# EAGLE design BottomPCB-011713 (EAGLE 6.3)
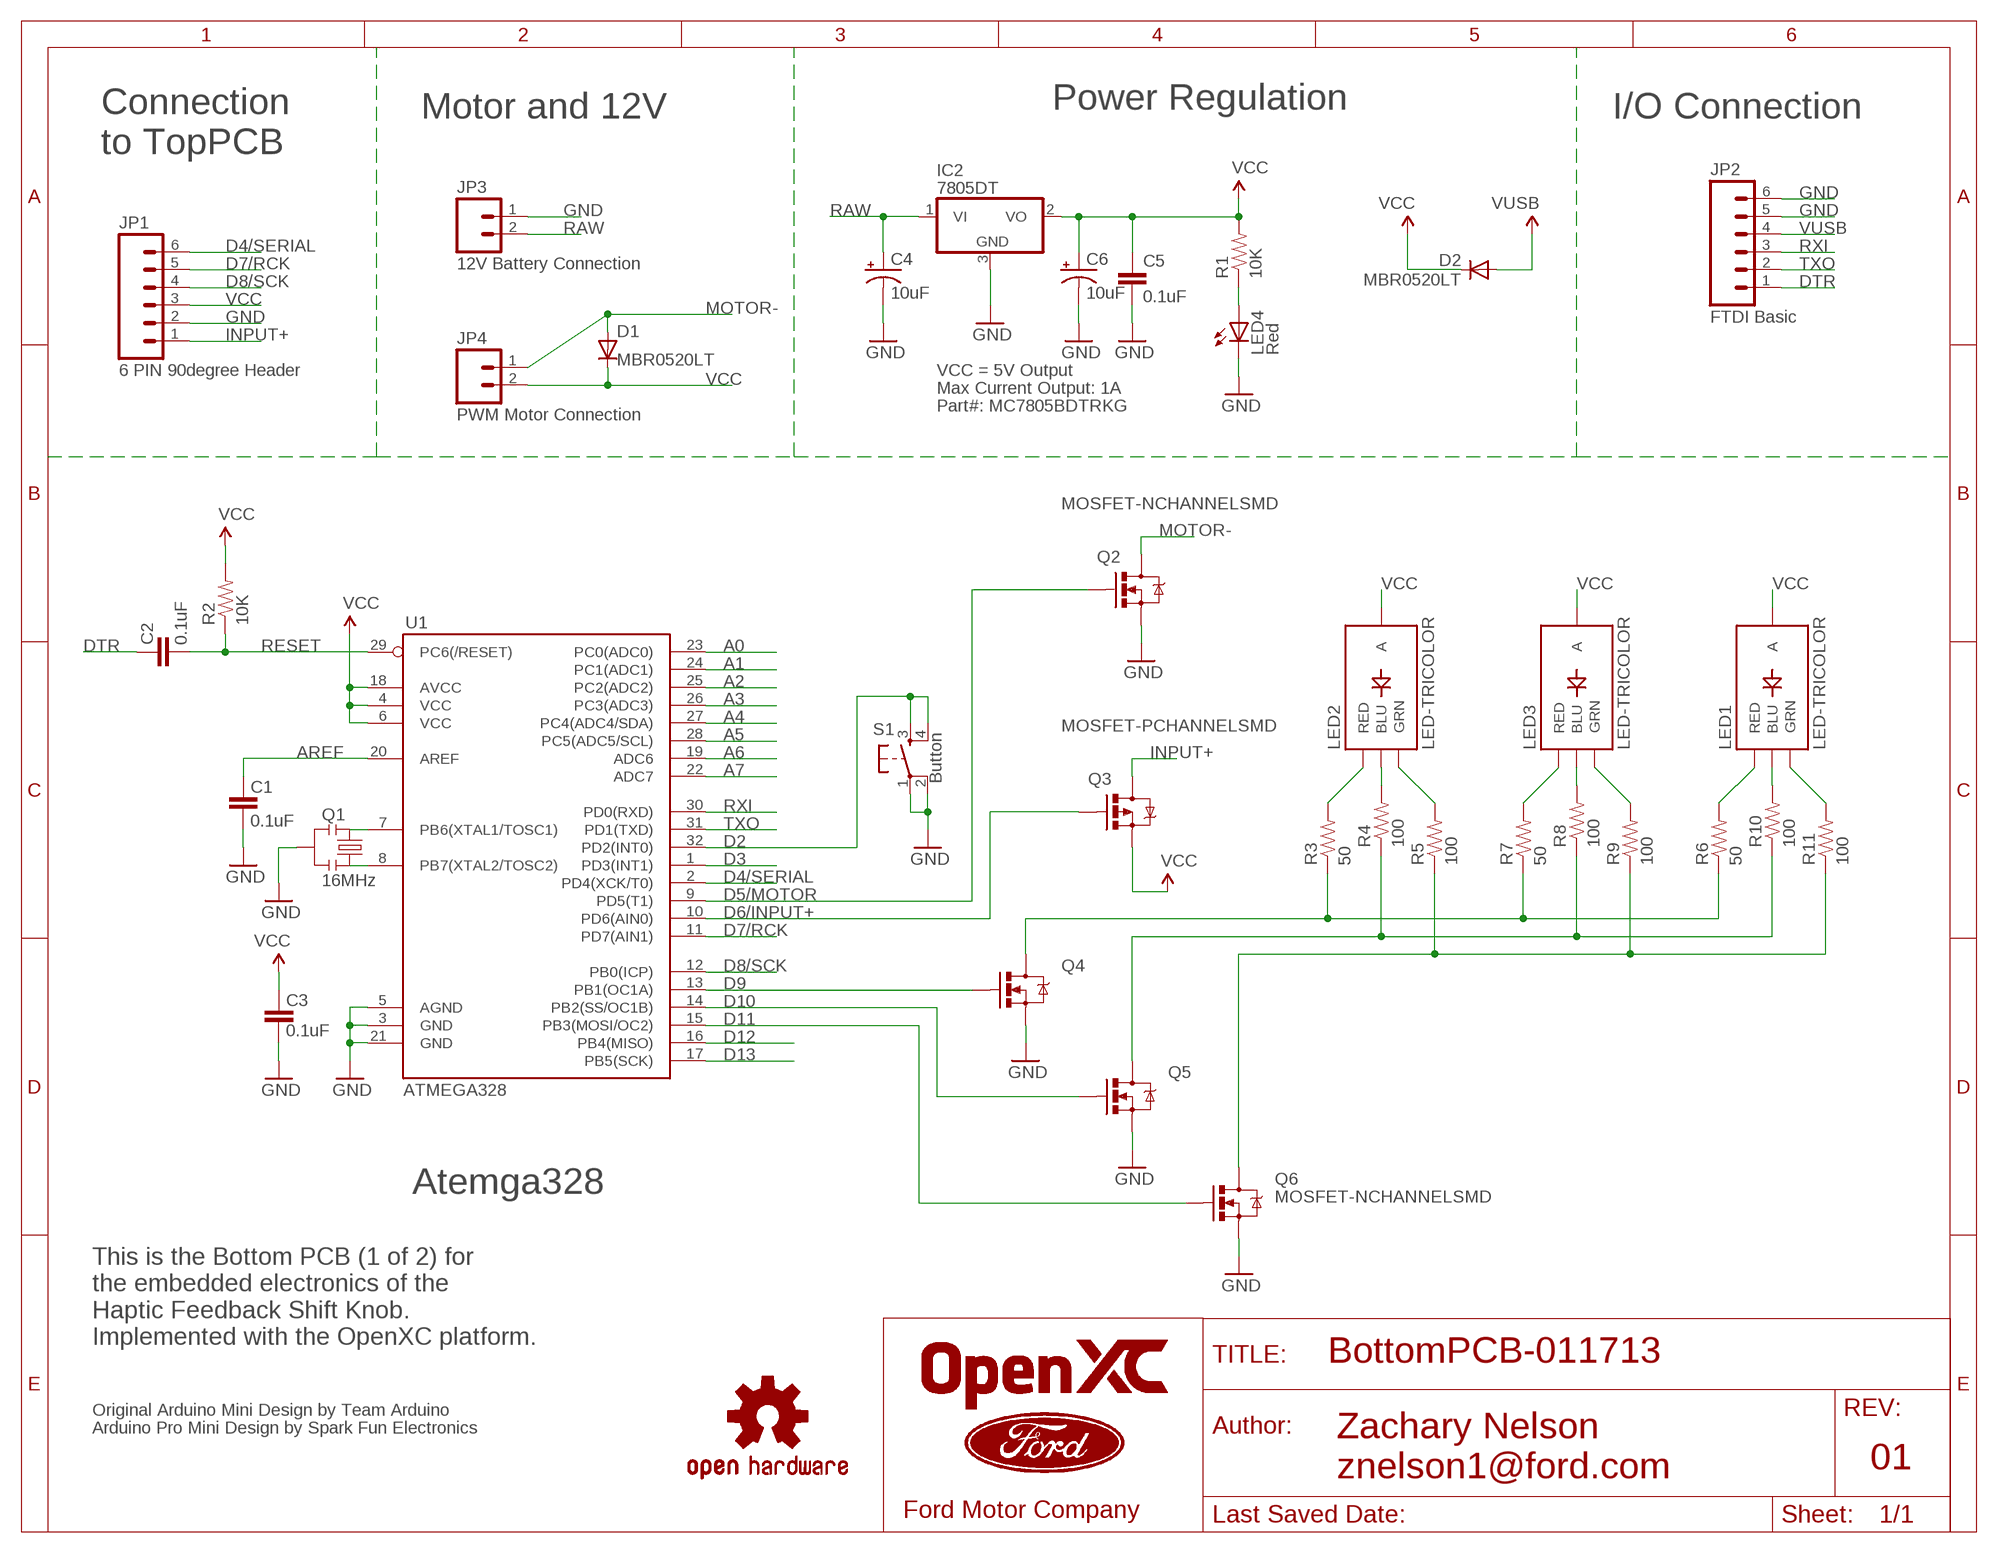
[diagram p0: schematic, sheet 1]

## Parts
C1  0.1uF  CAP0402-CAP  [0402-CAP]
C2  0.1uF  CAP0402-CAP  [0402-CAP]
C3  0.1uF  CAP0402-CAP  [0402-CAP]
C4  10uF  CAP_POL1206  [EIA3216]
C5  0.1uF  CAP0402-CAP  [0402-CAP]
C6  10uF  CAP_POL1206  [EIA3216]
D1  MBR0520LT  [SOD123]
D2  MBR0520LT  [SOD123]
IC2  7805DT  [TO252]
JP1  6 PIN 90degree Header  M06SIP  [1X06]
JP2  FTDI Basic  M06SIP  [1X06]
JP3  12V Battery Connection  M02-JST-2MM-SMT  [JST-2-SMD]
JP4  PWM Motor Connection  M02-JST-2MM-SMT  [JST-2-SMD]
LED1  LED-TRICOLOR  [LED-TRICOLOR-SMD]
LED2  LED-TRICOLOR  [LED-TRICOLOR-SMD]
LED3  LED-TRICOLOR  [LED-TRICOLOR-SMD]
LED4  Red  LED0603  [LED-0603]
Q1  16MHz  RESONATORSMD  [RESONATOR-SMD]
Q2  MOSFET-NCHANNELSMD  [SOT23-3]
Q3  MOSFET-PCHANNELSMD  [SOT23-3]
Q4  MOSFET-NCHANNELSMD  [SOT23-3]
Q5  MOSFET-NCHANNELSMD  [SOT23-3]
Q6  MOSFET-NCHANNELSMD  [SOT23-3]
R1  10K  RESISTOR0402-RES  [0402-RES]
R2  10K  RESISTOR0402-RES  [0402-RES]
R3  50  RESISTOR0805-RES  [0805]
R4  100  RESISTOR0805-RES  [0805]
R5  100  RESISTOR0805-RES  [0805]
R6  50  RESISTOR0805-RES  [0805]
R7  50  RESISTOR0805-RES  [0805]
R8  100  RESISTOR0805-RES  [0805]
R9  100  RESISTOR0805-RES  [0805]
R10  100  RESISTOR0805-RES  [0805]
R11  100  RESISTOR0805-RES  [0805]
S1  Button  TAC_SWITCHSMD  [TACTILE_SWITCH_SMD]
U1  ATMEGA328  ATMEGA168  [TQFP32-08]
U$3  OSHW-LOGOS  [OSHW-LOGO-S]

## Nets
A0: U1.23(PC0(ADC0))
A1: U1.24(PC1(ADC1))
A2: U1.25(PC2(ADC2))
A3: U1.26(PC3(ADC3))
A4: U1.27(PC4(ADC4/SDA))
A5: U1.28(PC5(ADC5/SCL))
A6: U1.19(ADC6)
A7: U1.22(ADC7)
AREF: C1.2 U1.20(AREF)
D2: S1.3 S1.4 U1.32(PD2(INT0))
D3: U1.1(PD3(INT1))
D4/SERIAL: JP1.6 U1.2(PD4(XCK/T0))
D5/MOTOR: Q2.1(G) U1.9(PD5(T1))
D6/INPUT+: Q3.1(G) U1.10(PD6(AIN0))
D7/RCK: JP1.5 U1.11(PD7(AIN1))
D8/SCK: JP1.4 U1.12(PB0(ICP))
D9: Q4.3(D) R3.1 R6.1 R7.1
D10: Q5.3(D) R4.1 R8.1 R10.1
D11: Q6.3(D) R5.1 R9.1 R11.1
D12: U1.16(PB4(MISO))
D13: U1.17(PB5(SCK))
DTR: C2.2 JP2.1
GND: C1.1 C3.1 C4.C(-) C5.2 C6.C(-) IC2.3(GND) JP1.2 JP2.5 JP2.6 JP3.1 LED4.C Q1.2 Q2.2(S) Q4.2(S) Q5.2(S) Q6.2(S) S1.1 S1.2 U1.3(GND) U1.5(AGND) U1.21(GND)
INPUT+: JP1.1 Q3.3(D)
MOTOR-: D1.A JP4.1 Q2.3(D)
N$1: Q1.1 U1.8(PB7(XTAL2/TOSC2))
N$2: Q1.3 U1.7(PB6(XTAL1/TOSC1))
N$3: LED4.A R1.1
N$4: LED2.R(RED) R3.2
N$5: LED2.G(GRN) R5.2
N$6: LED3.R(RED) R7.2
N$7: LED1.B(BLU) R10.2
N$8: LED3.G(GRN) R9.2
N$9: LED1.R(RED) R6.2
N$10: LED1.G(GRN) R11.2
N$11: Q4.1(G) U1.13(PB1(OC1A))
N$12: Q5.1(G) U1.14(PB2(SS/OC1B))
N$15: Q6.1(G) U1.15(PB3(MOSI/OC2))
N$16: LED3.B(BLU) R8.2
N$25: LED2.B(BLU) R4.2
RAW [vcc]: C4.A(+) IC2.1(VI) JP3.2
RESET: C2.1 R2.1 U1.29(PC6(/RESET))
RXI: JP2.3 U1.30(PD0(RXD))
TXO: JP2.2 U1.31(PD1(TXD))
VCC: C3.2 C5.1 C6.A(+) D1.C D2.C IC2.2(VO) JP1.3 JP4.2 LED1.A LED2.A LED3.A Q3.2(S) R1.2 R2.2 U1.4(VCC) U1.6(VCC) U1.18(AVCC)
VUSB: D2.A JP2.4

## Notes on the sheet
- Motor and 12V | Power Regulation | I/O Connection
- Connection
  to TopPCB
- VCC = 5V Output
- Max Current Output: 1A
- Part#: MC7805BDTRKG
- Atemga328
- This is the Bottom PCB (1 of 2) for 
  the embedded electronics of the 
  Haptic Feedback Shift Knob. 
  Implemented with the OpenXC platform.
- Original Arduino Mini Design by Team Arduino
- Arduino Pro Mini Design by Spark Fun Electronics
- 01
- Zachary Nelson
  znelson1@ford.com

## Library data of the parts
C1-C3 C5 = SparkFun:CAP: Capacitor Standard 0603 ceramic capacitor, and 0.1" leaded capacitor.
C4 C6 = SparkFun:CAP_POL: Capacitor Polarized These are standard SMD and PTH capacitors. Normally 10uF, 47uF, and 100uF in electrolytic and tantalum varieties. Always verify the external diameter of the through hole cap, it varies with capacity, voltage, and manufacturer. The EIA devices should be standard.
D1 D2 = diode:MBR0520LT: SCHOTTKY BARRIER RECTIFIER Source: http://onsemi.com .. MBR0520LT1-D.pdf
IC2 = linear:78*: Positive VOLTAGE REGULATOR Source: http://cache.national.com/ds/LM/LM78L05.pdf http://www.fairchildsemi.com/ds/LM/LM7805.pdf
JP1 JP2 = SparkFun-Connectors:M06: Header 6 Standard 6-pin 0.1" header. Use with straight break away headers (SKU : PRT-00116), right angle break away headers (PRT-00553), swiss pins (PRT-00743), machine pins (PRT-00117), and female headers (PRT-00115). Molex polarized connector foot print use with SKU : PRT-08094 with associated crimp pins and housings. NOTES ON THE VARIANTS LOCK and LOCK_LONGPADS... This footprint was designed to help hold the alignment of a through-hole component (i.e. 6-pin header) while soldering it into place. You may notice that each hole has been shifted either up or down by 0.005 of an inch from it's more standard position (which is a perfectly straight line). This slight alteration caused the pins (the squares in the middle) to touch the edges of the holes. Because they are alternating, it causes a "brace" to hold the component in place. 0.005 has proven to be the perfect amount of "off-center" position when using our standard breakaway headers. Although looks a little odd when you look at the bare footprint, once you have a header in there, the alteration is very hard to notice. Also, if you push a header all the way into place, it is covered up entirely on the bottom side. This idea of altering the position of holes to aid alignment will be further integrated into the Sparkfun Library for other footprints. It can help hold any component with 3 or more connection pins.
JP3 JP4 = SparkFun-Connectors:M02: Header 2 Standard 2-pin 0.1" header. Use with straight break away headers (SKU : PRT-00116), right angle break away headers (PRT-00553), swiss pins (PRT-00743), machine pins (PRT-00117), and female headers (PRT-00115). Molex polarized connector foot print use with SKU : PRT-08233 with associated crimp pins and housings.; PROD_ID: CONN-08352
LED1-LED3 = SparkFun:LED-TRICOLOR: Tri-Color LED SMD Proven layout and schematic for triple color LED in SMD package - common anode. Spark Fun Electronics SKU : COM-07844
LED4 = SparkFun:LED: LEDs Standard schematic elements and footprints for 5mm, 3mm, 1206, and 0603 sized LEDs. 5mm - Spark Fun Electronics SKU : COM-00529 (and others)
Q1 = SparkFun:RESONATOR: Resonator Small SMD resonator. This is the itty bitty 10/20MHz resonators with built in caps. CSTCE10M0G55 and CSTCE20M0V53. Footprint has been reviewed closely but hasn't been tested yet.
Q2 Q4-Q6 = SparkFun-DiscreteSemi:MOSFET-NCHANNEL: Generic NMOS footprint
Q3 = SparkFun-DiscreteSemi:MOSFET-PCHANNEL: Generic PMOSFET
R1 R2 = SparkFun:RESISTOR: Resistor Basic schematic elements and footprints for 0603, 1206, and PTH resistors.
R3-R11 = SparkFun-Resistors:RESISTOR: Resistor Basic schematic elements and footprints for 0603, 1206, and PTH resistors.
S1 = SparkFun:TAC_SWITCH: Momentary Switch Button commonly used for reset or general input. Spark Fun Electronics SKU : COM-00097
U1 = SparkFun:ATMEGA168
U$3 = SparkFun:OSHW-LOGO: Open Source Hardware Logo This logo indicates the piece of hardware it is found on incorporates a OSHW license and/or adheres to the definition of open source hardware found here: http://freedomdefined.org/OSHW

## Net classes
1 vcc: width 0.254 mm

## Board
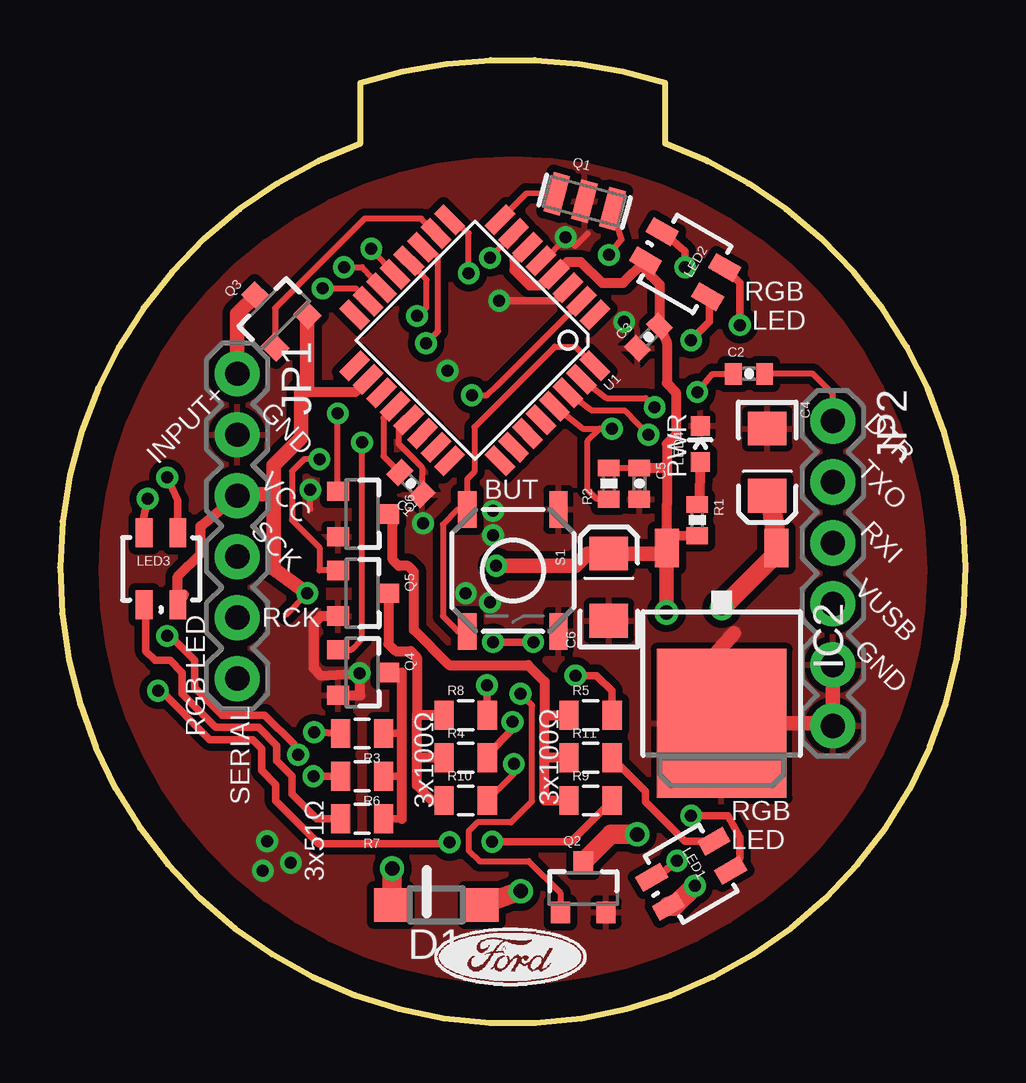
[diagram p1: board, top side]
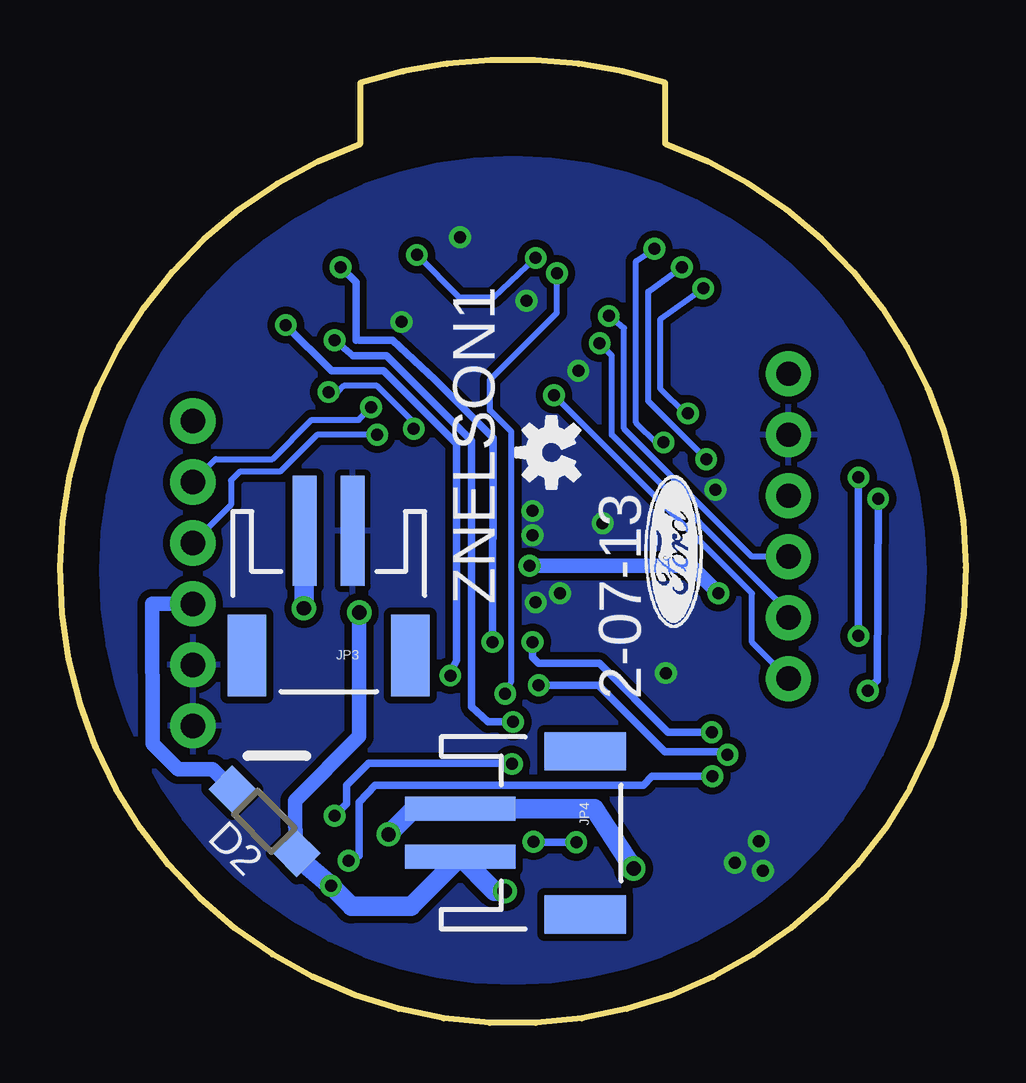
[diagram p2: board, bottom side, seen from below]

Size 37.76 x 40.12 mm. Coordinates in mm from the lower left corner, seen from the top.
Outline: 12.53,36.64 12.53,39.18 arc-35 25.23,39.18 25.23,36.64 arc-321 12.53,36.64
Copper layers (1*16): Top 0.0178mm / dielectric 59mil / Bottom 0.0178mm
Design rules "SSC-EAGLE-2Lyr_v1.0.0.3": minimum track width 6mil, minimum drill 14mil, track to track 6mil, track to pad 6mil, pad to pad 6mil, via to via 6mil, smd to smd 6mil, copper to edge 20mil, drill to drill 16mil, minimum pad ring 8mil, minimum via ring 8mil, stop-mask expansion 3mil, vias tented up to drill 0mil, thermal gap 10mil

### Footprints (pad centres in the part's own frame; a part is rotated, then mirrored left to right if it is on the bottom)
0402-CAP = smd 0.7 x 0.9: 1 -0.65,0; 2 0.65,0
EIA3216 = smd 1.4 x 1.6: A 1.4,0; C -1.4,0
SOD123 = smd 1.4 x 1.4: A 1.9,0; C -1.9,0
TO252 = smd 1 x 1.6: 1 -2.28,-4.8; 2 2.28,-4.8 | smd 5.4 x 6.2: 3 0,2.5
1X06 = drill 1.016 pad 1.88: 1 0,0; 2 2.54,0; 3 5.08,0; 4 7.62,0; 5 10.16,0; 6 12.7,0
JST-2-SMD = smd 1 x 4.6: 1 -1,-3.7; 2 1,-3.7 | smd 1.6 x 3.4: NC1 -3.4,1.5; NC2 3.4,1.5
LED-TRICOLOR-SMD = smd 0.7 x 1.2: A 0.7,-1.5; B 0.7,1.5; G -0.7,1.5; R -0.7,-1.5
LED-0603 = smd 0.8 x 0.8: A 0,-0.75; C 0,0.75
RESONATOR-SMD = smd 0.7 x 1.7: 1 -1.2,0; 2 0,0; 3 1.2,0
SOT23-3 = smd 0.8 x 0.9: 1 -0.95,-1; 2 0.95,-1; 3 0,1.1
0402-RES = smd 0.7 x 0.9: 1 -0.65,0; 2 0.65,0
0805 = smd 0.8 x 1.2: 1 -0.9,0; 2 0.9,0
TACTILE_SWITCH_SMD = smd 1.524 x 0.762: 1 -2.54,1.905; 2 2.54,1.905; 3 -2.54,-1.905; 4 2.54,-1.905
TQFP32-08 = smd 1.27 x 0.559: 1 -4.293,2.8; 2 -4.293,2; 3 -4.293,1.2; 4 -4.293,0.4; 5 -4.293,-0.4; 6 -4.293,-1.2; 7 -4.293,-2; 8 -4.293,-2.8; 17 4.293,-2.8; 18 4.293,-2; 19 4.293,-1.2; 20 4.293,-0.4; 21 4.293,0.4; 22 4.293,1.2; 23 4.293,2; 24 4.293,2.8 | smd 0.559 x 1.27: 9 -2.8,-4.293; 10 -2,-4.293; 11 -1.2,-4.293; 12 -0.4,-4.293; 13 0.4,-4.293; 14 1.2,-4.293; 15 2,-4.293; 16 2.8,-4.293; 25 2.8,4.293; 26 2,4.293; 27 1.2,4.293; 28 0.4,4.293; 29 -0.4,4.293; 30 -1.2,4.293; 31 -2,4.293; 32 -2.8,4.293

### Placement (x,y rotation side)
C1  14.63,22.48 135 top
C2  28.72,27.05 0 top
C3  24.53,28.57 45 top
C4  29.49,23.37 270 top
C5  24.15,22.48 270 top
C6  22.88,18.16 90 top
D1  15.69,4.92 180 top
D2  29.23,8.41 135 bottom
IC2  27.58,14.98 180 top
JP1  7.39,27.05 270 top
JP2  32.22,25.08 270 top
JP3  26.56,16.81 180 bottom
JP4  17.37,7.92 270 bottom
LED1  26.31,6.22 300 top
LED2  26.06,31.62 240 top
LED3  4.21,18.92 0 top
LED4  26.69,24.13 0 top
Q1  21.87,34.24 345 top
Q2  21.81,5.61 0 top
Q3  8.93,29.53 45 top
Q4  12.6,14.6 270 top
Q5  12.6,17.91 270 top
Q6  12.6,21.21 270 top
R1  26.57,20.95 270 top
R2  22.88,22.48 90 top
R3  12.6,12.06 180 top
R4  16.91,11.05 0 top
R5  22.12,12.83 0 top
R6  12.6,10.29 180 top
R7  12.6,8.51 180 top
R8  16.91,12.83 0 top
R9  22.12,9.27 0 top
R10  16.91,9.27 0 top
R11  22.12,11.05 0 top
S1  18.88,18.86 270 top
U1  17.29,28.45 225 top
U$1  [DOCFIELD]  -49.7,-52.26 0 top  (outside the outline)
U$3  17.27,23.77 90 bottom

### Tracks (layer width: path | path; a pad name or v marks a point on that pad's centre or on a via)
AREF
  Top 0.254: U1.20 13.48,25.2 13.48,23.62 C1.2
D2
  Top 0.254: S1.3 17.05,21.4 | U1.32 22.28,27.39 21.5,28.18 20.63,28.18 17.28,24.82 17.28,22.97 16.97,22.67 S1.3 | S1.3 16.59,21.4 15.96,20.76 15.96,16.95 16.59,16.32 S1.4
D4/SERIAL  (via drill 0.5 pad 0.41)
  Top 0.254: v17.17,26.16 17.8,26.16 18.22,26.54 U1.2
  Top 0.305: 21.71,30.19 U1.2
  Bottom 0.254: JP1.6 8.91,15.87 8.91,17.91 v17.17,26.16
D5/MOTOR  (via drill 0.5 pad 0.41)
  Top 0.254: v17.04,31.24 17.04,32.91 U1.9 | v19.2,13.71 19.68,13.23 19.68,9.24 18.79,8.36 17.4,8.36 17.04,8 17.04,7.19 17.49,6.74 19.54,6.74 20.86,5.42 Q2.1
  Bottom 0.254: v19.2,13.71 18.95,14.22 18.95,24.64 19.83,25.53 19.83,26.8 17.04,29.59 v17.04,31.24
D6/INPUT+
  Top 0.254: U1.10 15.06,33.51 12.71,33.51 8.97,29.77 Q3.1
D7/RCK  (via drill 0.5 pad 0.41)
  Top 0.254: v15.26,28.32 15.77,28.83 15.77,31.92 U1.11
  Bottom 0.254: JP1.5 7.39,17.14 14.75,24.51 14.75,27.81 v15.26,28.32
D8/SCK  (via drill 0.5 pad 0.41)
  Top 0.254: v14.88,29.46 15.27,29.8 15.29,30.97 U1.12
  Bottom 0.254: JP1.4 8.91,19.43 14.25,24.76 14.25,28.95 v14.88,29.46
D9
  Top 0.305: 14.25,8.51 R7.1 | R6.1 14.25,10.29 | R3.1 14.25,12.06
  Top 0.406: Q4.3 14.25,14.6 14.25,12.06 14.25,10.29 14.25,8.51
D10
  Top 0.406: R8.1 14.88,12.83 | R4.1 14.88,11.05 | 14.88,11.05 14.88,12.83 | R10.1 15.52,9.27 14.88,9.9 14.88,11.05 | Q5.3 13.7,15.79 13.99,15.49 14.63,15.49 14.88,15.24 14.88,12.83
D11
  Top 0.406: 20.2,12.83 20.2,14.22 19.52,14.91 16.23,14.91 14.75,16.38 14.75,18.79 14.5,19.05 14.12,19.05 13.87,19.3 13.87,20.78 arc90 Q6.3 | 20.2,12.83 R5.1 | R11.1 20.2,11.05 | 20.2,11.05 20.2,12.83 | R9.1 20.2,9.27 20.2,11.05
DTR
  Top 0.254: JP2.1 32.22,26.22 31.39,27.05 C2.2
GND  (via drill 0.5)
  Top 0.254: 10.44,21.42 v10.44,22.22 | U1.21 14.12,24.71 14.12,24.13 15.09,23.16 C1.1 | U1.5 20.34,31.93 v21.08,32.74 21.49,32.38 21.99,32.89
  Top 0.305: U1.3 20.64,30.1 v18.31,30.1
  Top 0.406: Q4.2 12.52,13.65 v12.49,14.58 10.88,14.48 10.56,14.79 10.56,16.64 10.88,16.96 Q5.2
  Top 0.61: JP2.5 JP2.6 32.11,12.48 IC2.3 27.33,15.37 28.09,16.23
  other vias: 18.06,21.33 16.15,27.18 23.52,29.21 15.14,20.83 18.06,20.32 9.62,6.68 8.46,6.35 8.63,7.57 16.91,17.91 17.93,17.52
  pour Top (isolate 0.305): 1.73,18.86 arc-90 18.88,36 arc-90 36.02,18.86 arc-90 18.88,1.71 arc-90
  pour Bottom (isolate 0.305): 1.73,18.86 arc-90 18.88,36 arc-90 36.02,18.86 arc-90 18.88,1.71 arc-90
INPUT+
  Top 0.61: Q3.3 7.39,29.54 JP1.1
MOTOR-  (via drill 0.6)
  Top 0.813: Q2.3 22.96,7.86 v24.06,7.86 | D1.A 13.85,5.52 v13.85,6.43
  Bottom 0.813: v24.06,7.86 23,8.92 JP4.1 15.48,8.92 v13.85,6.43
N$1
  Top 0.254: Q1.1 19.45,34.57 U1.8
N$2  (via drill 0.5 pad 0.3, 0.5 pad 0.41)
  Top 0.254: v22.88,32 23.41,32.65 Q1.3 | v17.93,31.88 18.02,32 U1.7
  Bottom 0.254: v17.93,31.88 19.71,30.22 21.1,30.22 v22.88,32
N$3
  Top 0.406: R1.1 26.67,21.58 LED4.A
N$4  (via drill 0.5 pad 0.3)
  Top 0.305: R3.2 v10.59,12.11 | v18.06,15.87 v19.73,15.87 | v26.06,31.49 26.06,32.16 LED2.R
  Bottom 0.254: 25.3,28.45 25.42,28.45
  Bottom 0.305: v10.59,12.11 12.42,12.11 15.26,14.98 17.8,14.98 18.06,15.24 v18.06,15.87 | v19.73,15.87 19.71,24.38 22.12,26.8 23.9,28.45 25.3,28.45 | 25.42,28.45 25.42,30.86 v26.06,31.49
N$5  (via drill 0.5 pad 0.41)
  Top 0.305: R5.2 23.02,12.94 23.01,12.95 23.01,13.84 22.37,14.48 v21.49,14.48 | v28.34,29.08 28.34,30.84 LED2.G
  Bottom 0.305: v21.49,14.48 21.49,14.6 21.23,15.11 21.23,24.13 24.28,27.18 26.44,27.18 v28.34,29.08
N$6
  Top 0.305: R7.2 10.69,8.51 9.67,9.52 9.67,10.29 9.04,10.92 9.04,11.56 8.28,12.32 6.5,12.32 5.1,13.71 5.1,14.6 4.59,15.11 3.96,15.11 3.58,15.49 3.58,17.36 LED3.R
N$7  (via drill 0.5 pad 0.41)
  Top 0.254: 17.94,9.4 18.92,10.38 v18.92,10.79
  Top 0.305: LED1.B 28.34,6.88 28.34,7.75 27.84,8.63 v26.31,8.63 | R10.2 17.94,9.4
  Bottom 0.305: v26.31,8.63 25.8,9.14 25.8,9.9 24.89,10.82 19.02,10.82 v18.92,10.79
N$8  (via drill 0.5, 0.5 pad 0.41)
  Top 0.305: v3.65,21.84 3.45,20.87 LED3.G | v4.09,13.84 4.21,13.84 6.25,11.81 8.02,11.81 8.4,11.43 8.4,10.54 9,9.92 9,9.25 10.78,7.48 16.19,7.48 v16.24,7.53 | R9.2 21.3,7.55 v18.02,7.55
  Bottom 0.305: v3.65,21.84 3.68,14.27 v4.09,13.84 | v18.02,7.55 17.99,7.53 v16.24,7.53
N$9  (via drill 0.5 pad 0.41)
  Top 0.305: R6.2 v10.56,10.29 | v25.73,6.75 24.77,5.97 LED1.R
  Bottom 0.305: v25.73,6.75 25.3,6.96 25.3,9.21 24.62,9.9 18.31,9.9 arc0 13.44,9.91 13.07,10.29 v10.56,10.29
N$10
  Top 0.305: R11.2 24.41,9.66 24.41,9.21 26.04,7.58 LED1.G
N$11  (via drill 0.5, 0.5 pad 0.41)
  Top 0.254: v12.98,32.26 U1.13 | Q4.1 12.15,15.55 12.6,16 v12.6,24.19
  Bottom 0.254: v12.98,32.26 13.74,31.75 13.74,25.02 12.85,24.13 v12.6,24.19
N$12  (via drill 0.5, 0.5 pad 0.41)
  Top 0.254: Q5.1 10.82,18.86 10.82,19.81 9.67,20.95 9.67,22.99 10.18,23.49 v10.82,23.49 | v11.83,31.49 12.6,31.49 U1.14
  Bottom 0.254: v11.83,31.49 13.23,30.48 13.23,25.91 v10.82,23.49
N$15  (via drill 0.5)
  Top 0.254: Q6.1 11.58,22.3 v11.58,25.4 | v10.94,30.61 12.34,30.61 U1.15
  Bottom 0.254: v10.94,30.61 12.72,29.34 12.72,26.41 11.71,25.4 v11.58,25.4
N$16  (via drill 0.5, 0.5 pad 0.41)
  Top 0.305: LED3.B 4.91,21.78 v4.47,22.73 | v17.8,14.07 R8.2 | v9.93,11.17 9.75,11.61 8.53,12.83 6.75,12.83 5.61,13.97 5.61,15.11 4.59,16.13 v4.47,16.13
  Bottom 0.305: v4.47,22.73 v4.47,16.13 | v17.8,14.07 15.31,14.07 12.54,11.3 10.18,11.3 v9.93,11.17
N$25  (via drill 0.5 pad 0.41)
  Top 0.305: R4.2 17.81,11.19 18.82,12.19 v18.87,12.55 | v26.31,28.45 27.07,29.21 27.07,30.2 LED2.B
  Bottom 0.305: v18.87,12.55 19.91,12.55 20.6,13.18 20.6,24.26 24.15,27.81 25.55,27.81 v26.31,28.45
RAW  (via drill 0.6)
  Top 0.813: v27.59,17.28 29.86,19.55 IC2.1 arc20 C4.A
  Bottom 0.813: JP3.2 v27.59,17.28
RESET  (via drill 0.5 pad 0.41)
  Top 0.254: v26.57,26.29 27.2,27.05 C2.1 | U1.29 21.8,24.76 22.5,24.76 | 22.5,24.76 v23.01,24.76 | R2.1 22.39,21.83 21.99,22.22 21.99,24.26 22.5,24.76
  Bottom 0.254: v23.01,24.76 22.88,24.89 24.53,26.54 25.93,26.54 26.18,26.29 v26.57,26.29
RXI  (via drill 0.5 pad 0.41)
  Top 0.254: U1.30 22.17,25.53 23.54,25.53 v24.53,24.51
  Bottom 0.254: JP2.3 30.63,21.59 30.63,22.6 30.25,22.99 30.23,22.97 28.58,22.97 27.04,24.51 v24.53,24.51
TXO  (via drill 0.5 pad 0.41)
  Top 0.254: U1.31 22.79,26.03 24.41,26.03 v24.79,25.65
  Bottom 0.254: JP2.2 31.26,23.49 28.9,23.49 27.26,25.13 25.31,25.13 v24.79,25.65
VCC  (via drill 0.5 pad 0.41, 0.6)
  Top 0.254: 9.42,17.02 v10.31,17.91 | R2.2 C5.1
  Top 0.305: U1.6 18.95,31.79 | 20.09,30.73 20.68,31.33 U1.4
  Top 0.406: 5.17,17.84 LED3.A 4.91,18.61 5.86,19.56 5.86,20.7 JP1.3 | U1.18 12.31,26.29 10.06,26.29 | 18.95,31.79 18.95,31.37 19.58,30.73 20.09,30.73 | U1.4 21.14,31.7 21.71,31.7 22.6,30.83 23.48,30.83 LED2.A 24.23,31.59 24.66,31.11 24.99,30.78 C3.2 25.3,28.35 25.3,26.67 25.68,26.29 25.68,24.51 25.3,24.13 25.3,23.24 | 25.3,23.24 25.3,21.59 IC2.2 25.31,20.32 R1.2 | C5.1 25.18,23.13 25.3,23.24
  Top 0.61: IC2.2 25.17,19.66 | IC2.2 25.3,19.56 C6.A 22,19.56 21.49,19.05 18.44,19.05 v18.18,19.05 | v10.31,17.91 8.91,18.92 8.91,22.03 | 8.91,22.03 8.91,23.24 10.06,24.38 10.06,26.29 10.31,26.54 Q3.2 | v25.28,17.1 25.28,19.76 IC2.2 | JP1.3 7.45,22.03 8.91,22.03
  Top 0.813: LED1.A 25.59,4.87 v26.46,5.71 | IC2.2 | v19.21,5.5 v19.2,5.51 D1.C
  Bottom 0.61: v10.31,17.91 11.45,19.05 v18.18,19.05 | 27.94,6.96 27.96,9.26 25.28,11.95 v25.28,17.1
  Bottom 0.813: D2.C 27.94,6.96 v26.46,5.71 25.61,4.86 23.13,4.86 JP4.2 19.64,5.5 v19.21,5.5
VUSB
  Bottom 0.61: JP2.4 33.92,17.46 33.89,11.64 32.82,10.58 31.4,10.58 D2.A

### Text on the board
tPlace: RGB / LED | GND | PWR | DTR | INPUT+ | TXO | VCC | BUT | SCK | RXI | VUSB | RGB LED | RCK | GND | SERIAL | 3x100Ω | 3x100Ω | 3x51Ω | RGB / LED
bPlace: ZNELSON1 | 2-07-13
Document: 01 | Zachary Nelson / znelson1@ford.com